# Altium schematic sheet Communication.SchDoc: NER A Size Template
size Tabloid; ApprovedBy: WS; DrawnBy: Cameron Gordon; Address4: X.X.X; Revision: 1; SheetNumber: 3; SheetTotal: 3
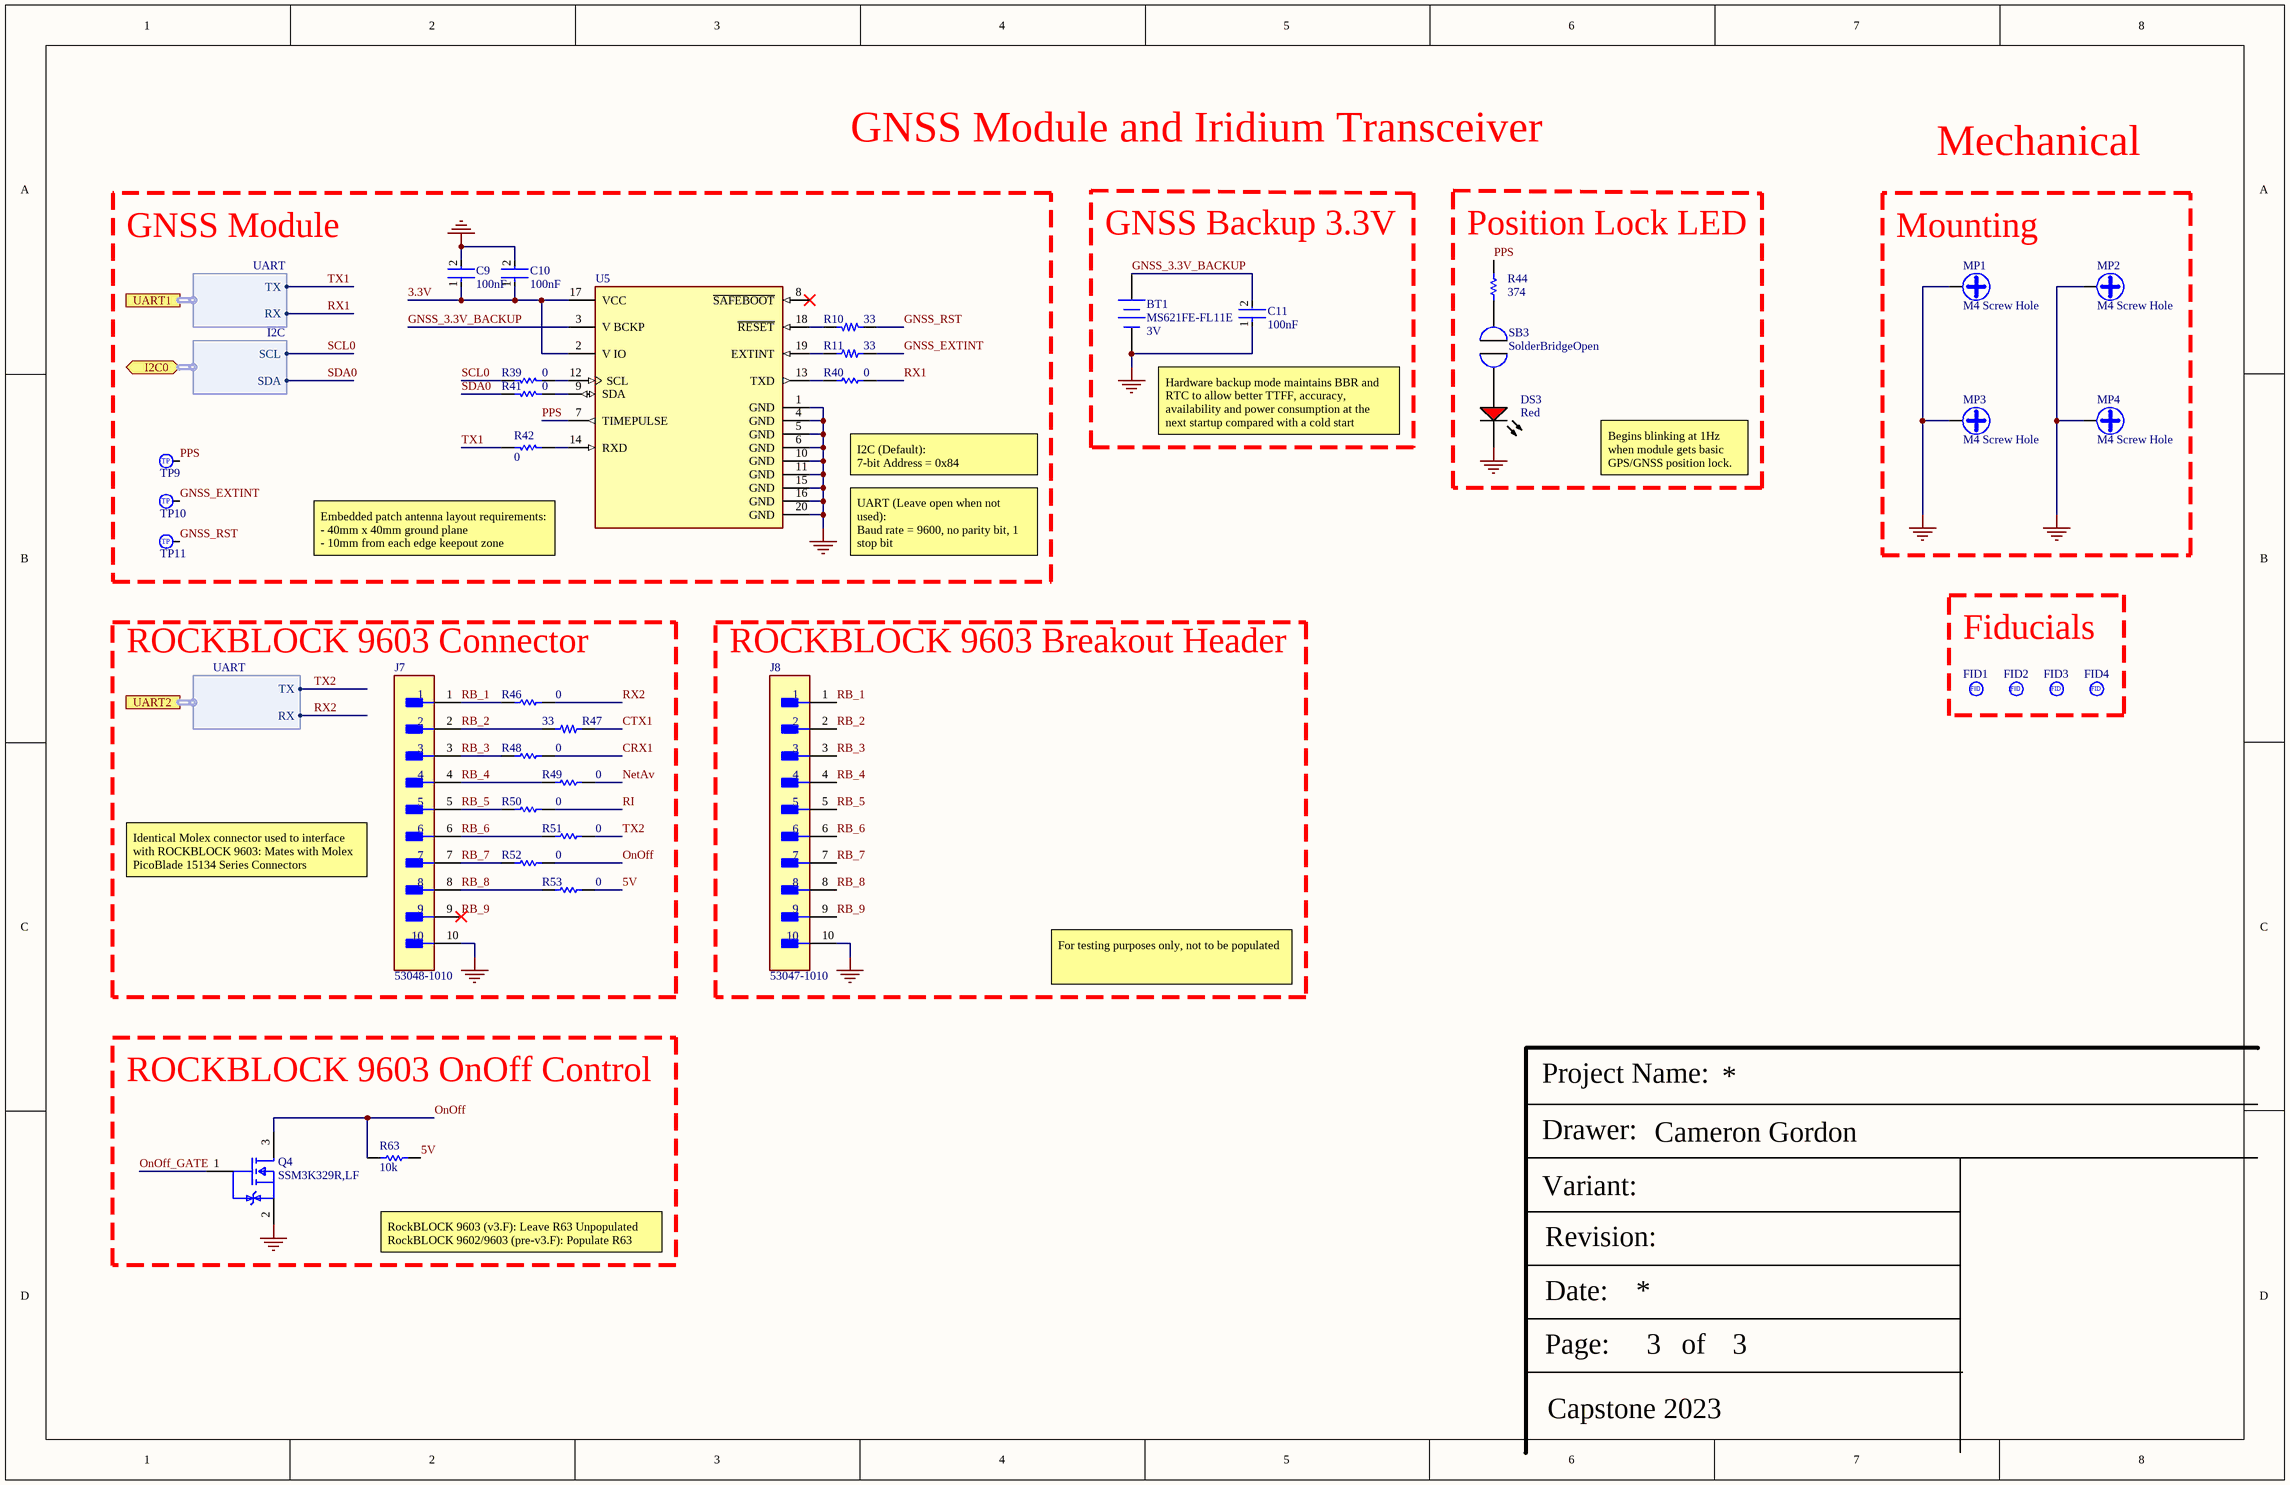
[diagram p0: Communication.SchDoc]

## Parts
BT1  MS621FE-FL11E  Output Voltage: 3V  [SEIK-MS621FE-FL11E-2_V]
C9  Capacitance: 100nF  [FP-CL10-IPC_C]  (hidden comment: CL10B104MB8NNNC)
C10  Capacitance: 100nF  [FP-CL10-IPC_C]  (hidden comment: CL10B104MB8NNNC)
C11  Capacitance: 100nF  [FP-CL10-IPC_C]  (hidden comment: CL10B104MB8NNNC)
DS3  Illumination Colour: Red  [LTST-C170KRKT_V]  (hidden comment: LTST-C170KRKT)
FID1  Fiducial  [40 mil Circular Test Point]  (value not drawn)
FID2  Fiducial  [40 mil Circular Test Point]  (value not drawn)
FID3  Fiducial  [40 mil Circular Test Point]  (value not drawn)
FID4  Fiducial  [40 mil Circular Test Point]  (value not drawn)
J7  53048-1010  [FP-53048-1010-MFG]
J8  53047-1010  [FP-53047-1010-MFG]
MP1  M4 Screw Hole  [New footprint 1]
MP2  M4 Screw Hole  [New footprint 1]
MP3  M4 Screw Hole  [New footprint 1]
MP4  M4 Screw Hole  [New footprint 1]
Q4  SSM3K329R,LF  [FP-2-3Z1A-MFG]
R10  Resistance: 33  [0603 Resistor]  (hidden comment: CRGCQ0603J33R)
R11  Resistance: 33  [0603 Resistor]  (hidden comment: CRGCQ0603J33R)
R39  Resistance: 0  [RESC1608X55X25ML10T15]  (hidden comment: RC0603JR-070RL)
R40  Resistance: 0  [RESC1608X55X25ML10T15]  (hidden comment: RC0603JR-070RL)
R41  Resistance: 0  [RESC1608X55X25ML10T15]  (hidden comment: RC0603JR-070RL)
R42  Resistance: 0  [RESC1608X55X25ML10T15]  (hidden comment: RC0603JR-070RL)
R44  value 374  [RESC2013X60X35ML10T20]  (hidden comment: RC0805FR-07374RL)
R46  Resistance: 0  [RESC1608X55X25ML10T15]  (hidden comment: RC0603JR-070RL)
R47  Resistance: 33  [0603 Resistor]  (hidden comment: CRGCQ0603J33R)
R48  Resistance: 0  [RESC1608X55X25ML10T15]  (hidden comment: RC0603JR-070RL)
R49  Resistance: 0  [RESC1608X55X25ML10T15]  (hidden comment: RC0603JR-070RL)
R50  Resistance: 0  [RESC1608X55X25ML10T15]  (hidden comment: RC0603JR-070RL)
R51  Resistance: 0  [RESC1608X55X25ML10T15]  (hidden comment: RC0603JR-070RL)
R52  Resistance: 0  [RESC1608X55X25ML10T15]  (hidden comment: RC0603JR-070RL)
R53  Resistance: 0  [RESC1608X55X25ML10T15]  (hidden comment: RC0603JR-070RL)
R63  Resistance: 10k  [RESC1609X55X30LL15T15]  (hidden comment: ERJ3EKF1002V)
SB3  SolderBridgeOpen  [SOLDERBRIDGEOPEN]
TP9  0.040" Circular Test Point  [40 mil Circular Test Point]  (value not drawn)
TP10  0.040" Circular Test Point  [40 mil Circular Test Point]  (value not drawn)
TP11  0.040" Circular Test Point  [40 mil Circular Test Point]  (value not drawn)
U5  SAM-M10Q-00B  [FP-SAM-M10Q-00B-MFG]  (value not drawn)

## Blocks framed on the sheet
GNSS Module: C9 C10 R10 R11 R39-R42 TP9-TP11 U5
GNSS Backup 3.3V: BT1 C11
Position Lock LED: DS3 R44 SB3
Mounting: MP1-MP4
ROCKBLOCK 9603 Connector: J7 R46-R53
ROCKBLOCK 9603 Breakout Header: J8
Fiducials: FID1-FID4
ROCKBLOCK 9603 OnOff Control: Q4 R63

## Ports
I2C0 (bidir, harness I2C), UART1 (harness UART), UART2 (harness UART)

## Harnesses
UART: TX, RX
I2C: SCL, SDA

## Nets
GND: BT1.2(-) C9.2 C10.2 C11.1 DS3.2(K) J7.10 J8.10 MP1.1 MP2.1 MP3.1 MP4.1 Q4.2(SOURCE) U5.1(GND) U5.4(GND) U5.5(GND) U5.6(GND) U5.10(GND) U5.11(GND) U5.15(GND) U5.16(GND) U5.20(GND)
3.3V: C9.1 C10.1 U5.2(V_IO) U5.17(VCC)
5V: R53.1 R63.1
CRX1: R48.1
CTX1: R47.2
GNSS_3.3V_BACKUP: BT1.1(+) C11.2 U5.3(V_BCKP)
GNSS_EXTINT: R11.2 TP10.1
GNSS_RST: R10.1 TP11.1
NetAv: R49.1
OnOff: Q4.3(DRAIN) R52.1 R63.2
OnOff_GATE: Q4.1(GATE)
PPS: R44.1 TP9.1 U5.7(TIMEPULSE)
RB_1: J7.1 J8.1 R46.2
RB_2: J7.2 J8.2 R47.1
RB_3: J7.3 J8.3 R48.2
RB_4: J7.4 J8.4 R49.2
RB_5: J7.5 J8.5 R50.2
RB_6: J7.6 J8.6 R51.2
RB_7: J7.7 J8.7 R52.2
RB_8: J7.8 J8.8 R53.2
RB_9: J7.9 J8.9
RI: R50.1
RX1: R40.1 ; port UART1.RX
RX2: R46.1 ; port UART2.RX
SCL0: R39.1 ; port I2C0.SCL
SDA0: R41.1 ; port I2C0.SDA
TX1: R42.1 ; port UART1.TX
TX2: R51.1 ; port UART2.TX
NetDS3_1: DS3.1(A) SB3.1
NetR10_2: R10.2 U5.18(~{RESET})
NetR11_1: R11.1 U5.19(EXTINT)
NetR39_2: R39.2 U5.12(SCL)
NetR40_2: R40.2 U5.13(TXD)
NetR41_2: R41.2 U5.9(SDA)
NetR42_2: R42.2 U5.14(RXD)
NetR44_2: R44.2 SB3.2

Not connected (* = marked no-connect by the designer): U5 8(~{SAFEBOOT})*

## Notes on the sheet
- GNSS Module and Iridium Transceiver
- Mechanical
- Hardware backup mode maintains BBR and RTC to allow better TTFF, accuracy, availability and power consumption at the next startup compared with a cold start
- I2C (Default):
  7-bit Address = 0x84
- Begins blinking at 1Hz when module gets basic GPS/GNSS position lock.
- Embedded patch antenna layout requirements:
  - 40mm x 40mm ground plane
  - 10mm from each edge keepout zone
- UART (Leave open when not used):
  Baud rate = 9600, no parity bit, 1 stop bit
- Identical Molex connector used to interface with ROCKBLOCK 9603: Mates with Molex PicoBlade 15134 Series Connectors
- For testing purposes only, not to be populated
- RockBLOCK 9603 (v3.F): Leave R63 Unpopulated
  RockBLOCK 9602/9603 (pre-v3.F): Populate R63
- Project Name:
- Drawer:
- Variant:
- Revision:
- Date:
- Page:
- of
- Capstone 2023
- (in symbol CMP-00017-2) TP
- (in symbol CMP-00019-1) FID

## Library data of the parts
BT1 = CMP-2000-05342-1: MS Lihium Rechargeable Battery, 3 V, -20 to 60 degC, Tray; Manufacturer: SeikoInstruments; Brand: SeikoInstrumentsMicroEnergy; Capacity: 5.5mAh; Chemistry: Lithium; Battery Size: 621; Unit Weight: 0.008113oz; Datasheet URL: http://datasheet.octopart.com/MS621FE-FL11E-Seiko-datasheet-5320152.pdf; Rechargeable/Non-Rechargeable: Rechargeable; Orientation: Vertical; Height: 2.1mm; Series: MS; Datasheet Version: Jan-08; Type: CoinCellBatterywithLeads; Diameter: 6.8mm; Mounting Style: WithLeads; Product Category: CoinCellBattery; Termination Style: ThroughHole; Packaging: Tray; Manufacturer URL: http://www.sii.co.jp/en/; RoHS: NotApplicable; Factory Pack Quantity: 100
C9-C11 = CMP-13271-001724-1: Cap Ceramic 100nF 50V X7R ±20% Pad SMD 0603 +125°C T/R; Mount: Surface Mount; Lead Free: Lead Free; Max Operating Temperature: 125°C; Voltage Rating: 50V; Case Code (Imperial): 0603; Height: 0.8mm; Length: 1.6mm; Tolerance: 20%; Case Code (Metric): 1608; Thickness: 0.035inch; Depth: 0.8mm; Width: 0.031inch; Package Quantity: 1; Min Operating Temperature: -55°C; Case/Package: 0603; Radiation Hardening: No; Voltage Rating (DC): 50V; Dielectric: X7R; Packaging: Tape and Reel
DS3 = CMP-2000-07593-1: LED Red, 75 mW, 54 mcd, -55 to 85 degC, 2-Pin SMD, RoHS, Tape and Reel; Manufacturer: Lite-On; Lens Transparency: Clear; Number of Elements: 1; Power Rating: 75mW; Luminous Intensity: 54mcd; Viewing Angle: 130degrees; Forward Current: 30mA; Wavelength: 639nm; Lens Style: Rectangular; Case\/Package: 0805; Test Current: 20mA; Dominant Wavelength: 631nm; Forward Voltage: 2V; Lens Colour: Colorless; Min Operating Temperature: -55degC; RoHSCompliant: True; Length: 3.2mm; Width: 1.25mm; Mount: SurfaceMount; Packaging: TapeandReel; Number of LEDs: 1; Radiation Hardening: No; Datasheet URL: http://optoelectronics.liteon.com/upload/download/DS-22-99-0150/LTST-C170KRKT.pdf; Datasheet Version: Rev. D, 11/2014; Case Code (Metric): 2012; Height: 1.1mm; Number of Pins: 2; Package Description: 2-Pin Surface Mount Device, Body 2 x 1.25 mm; Manufacturer URL: http://www.us.liteon.com/; Lead Free: LeadFree; Colour: Red; Case Code (Imperial): 0805; Max Operating Temperature: 85degC; Power Dissipation: 75mW; Mounting Technology: SurfaceMount; Package Reference: C170KRKT; Package Quantity: 1; Depth: 1.6mm
FID1-FID4 = CMP-00019-1
J7 = CMP-04776-000812-1: CONN HEADER R/A 10POS 1.25MM; Number of Positions: 10; Glow Wire Compliant: Non-compliant; Current Rating: 1A; Voltage Rating (AC): 125V; Contact Resistance: 20mR; Body Plating: Tin; Insulation Resistance: 100MR; Gender: Male; Max Operating Temperature: 85°C; Contact Plating: Tin; Orientation: Right Angle; Housing Color: Natural; Number of Rows: 1; RoHS Compliant: Yes; Number of Contacts: 10; Series: PicoBlade; Package Quantity: 2000; Pitch: 1.25mm; Number of Circuits: 10; Lead Pitch: 1.25mm; Min Operating Temperature: -40°C; Height: 3.5mm; Mount: Through Hole; Voltage Rating (DC): 125V; Voltage Rating: 125V; Packaging: Tray; Radiation Hardening: No; Depth: 5.5mm; Lead Free: Lead Free; Flammability Rating: UL94 V-0; Max Voltage Rating (AC): 125V; Working Voltage: 125V; Termination: Solder; Contact Material: Bronze; Length: 14.25mm; Color: Natural; Number of Poles: 10; Housing Material: Nylon; Max Current Rating: 1A
J8 = CMP-002-00108-1: Board Connector, 10 Contact(s), 1 Row(s), Male, Straight, 0.049 inch Pitch, Solder Terminal, Locking, White Insulator, Receptacle; Current Rating: 0A; Gender: Pin; Voltage Rating: 0V; Number of Contacts: 10; Orientation: Vertical; Mounting Type: Through Hole
MP1-MP4 = CMP-00024-1: Plated hole for M4 mounting hardware
Q4 = CMP-35916-000013-1: MOSFET N CH 30V 3.5A 2-3Z1A; Gate to Source Voltage (Vgs): 12V; Input Capacitance: 123pF; Drain to Source Resistance: 290mR; Rds On Max: 126mR; Max Power Dissipation: 1W; Continuous Drain Current (ID): 3.5A; Mount: Surface Mount; Case/Package: SOT-23-3; Drain to Source Breakdown Voltage: 30V; Packaging: Tape and Reel; Drain to Source Voltage (Vdss): 30V; Power Dissipation: 1W; Package Quantity: 3000
R10 R11 R47 = CMP-00148-2: Res Thick Film 0603 33 Ohm 5% 0.1W(1/10W) ±200ppm/C Pad SMD Automotive T/R; Power Rating: 100mW; Package: 0603; Tolerance: 5%
R39-R42 R46 R48-R53 = CMP-2100-03667-1: Chip Resistor, 0 Ohm, +/- 5%, 0.1 W, -55 to 155 degC, 0603 (1608 Metric), RoHS, Tape and Reel; Manufacturer: Yageo; Temperature Coefficient: 200ppm/degreesC; Voltage Rating: 50V; Power Rating: 100mW; Width: 0.8mm; Max Operating Temperature: 155degC; Tolerance: 5%; Package Reference: 0603; Height: 0.45mm; Depth: 0.8mm; Package Description: 2-Pin Surface Mount Device, Body 1.6 x 0.8 mm; Termination: SMD/SMT; Package Quantity: 5000; Case/Package: 0603; Case Code (Imperial): 0603; Radiation Hardening: No; Number of Pins: 2; Length: 1.6mm; Lead Free: LeadFree; Voltage Rating (DC): 50V; Military Standard: Not; Datasheet URL: http://www.yageo.com/NewPortal/yageodocoutput?fileName=/pdf/R-Chip/PYu-RC_Group_51_RoHS_L_5.pdf; Manufacturer URL: http://www.yageo.com/; Packaging: TapeandReel; Case Code (Metric): 1608; Min Operating Temperature: -55degC; Composition: ThickFilm; RoHSCompliant: true; Contact Plating: Tin; Datasheet Version: Rev. 5, 10/2016; REACH SVHC: NoSVHC
R44 = CMP-2001-01105-1: Manufacturer: Yageo; Part Number: RC0805FR-07374RL
R63 = CMP-1012-00623-3: Chip Resistor, 10 KOhm, +/- 1%, 0.1 W, -55 to 155 degC, 0603 (1608 Metric), RoHS, Tape and Reel; Manufacturer: Panasonic; Voltage Rating: 75V; Case\/Package: 0603; Power Rating: 100mW; Temperature Coefficient: 100ppm\/degreesC; Number of Pins: 2; Package Reference: 603; Depth: 0.8mm; Mount: SurfaceMount; Package Description: 2-Pin Surface Mount Device, Body 1.6 x 0.85 mm; Datasheet Version: 02/2017; Length: 1.6mm; Lead Free: LeadFree; Height: 0.45mm; Number of Terminations: 2; Max Power Dissipation: 100mW; Min Operating Temperature: -55degC; Datasheet URL: https://industrial.panasonic.com/cdbs/www-data/pdf/RDA0000/AOA0000C304.pdf; Termination: SMD/SMT; Case Code (Metric): 1608; Case Code (Imperial): 0603; Tolerance: 1%; Max Operating Temperature: 155degC; RoHSCompliant: true; Voltage Rating (DC): 75V; Radiation Hardening: No; Packaging: TapeandReel; Composition: ThickFilm; Mounting Technology: SurfaceMount; Manufacturer URL: http://www.panasonic.com/; Width: 0.031inch; REACH SVHC: NoSVHC; Contact Plating: Tin; Military Standard: Not; Package Quantity: 1
TP9-TP11 = CMP-00017-2
U5 = CMP-020-00023-2: M10 Gnss LGA Patch Antenna Mod; Min Supply Voltage: 1.8V; Max Supply Voltage: 3.3V; Case/Package: Custom